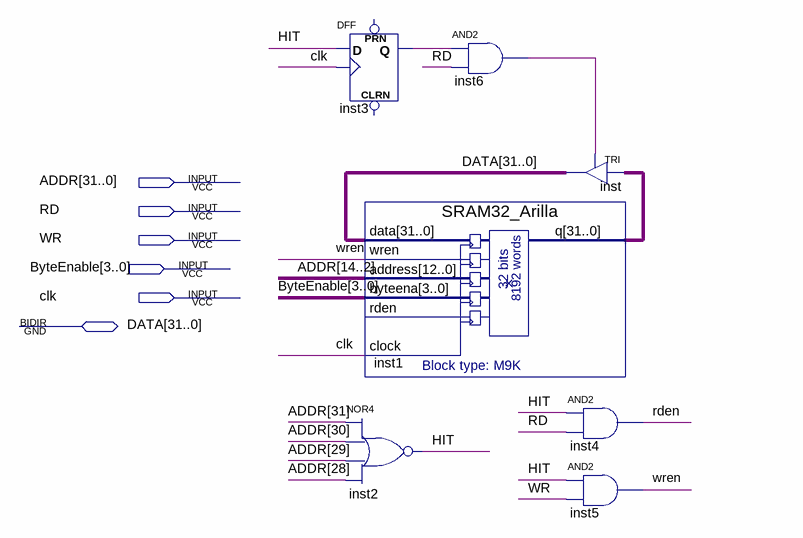
[diagram p0: schematic sheet]
// Quartus schematic SRAMAdapter.bdf as structural Verilog: 7 symbols, 6 pins
module SRAMAdapter (
  input  [31:0] ADDR,
  input  RD,
  input  WR,
  input  [3:0] ByteEnable,
  input  clk,
  inout  [31:0] DATA
);

  wire HIT, inst3_q, inst6_out, rden, wren;
  wire [31:0] inst1_q;

  DFF inst3 (.CLK(clk), .D(HIT), .Q(inst3_q));  // open: CLRN, PRN
  nor inst2 (HIT, ADDR[31], ADDR[30], ADDR[29], ADDR[28]);
  SRAM32_Arilla inst1 (
    .data(DATA), .wren(wren), .address(ADDR[14:2]), .byteena(ByteEnable), .clock(clk), .q(inst1_q));  // open: rden
  and inst6 (inst6_out, inst3_q, RD);
  TRI inst[31:0] (.IN(inst1_q), .OE(inst6_out), .OUT(DATA));
  and inst4 (rden, HIT, RD);
  and inst5 (wren, HIT, WR);
endmodule
